# Altium schematic sheet TopLevel.SchDoc
size 420 x 297 mm; SheetNumber: 1; SheetTotal: 7
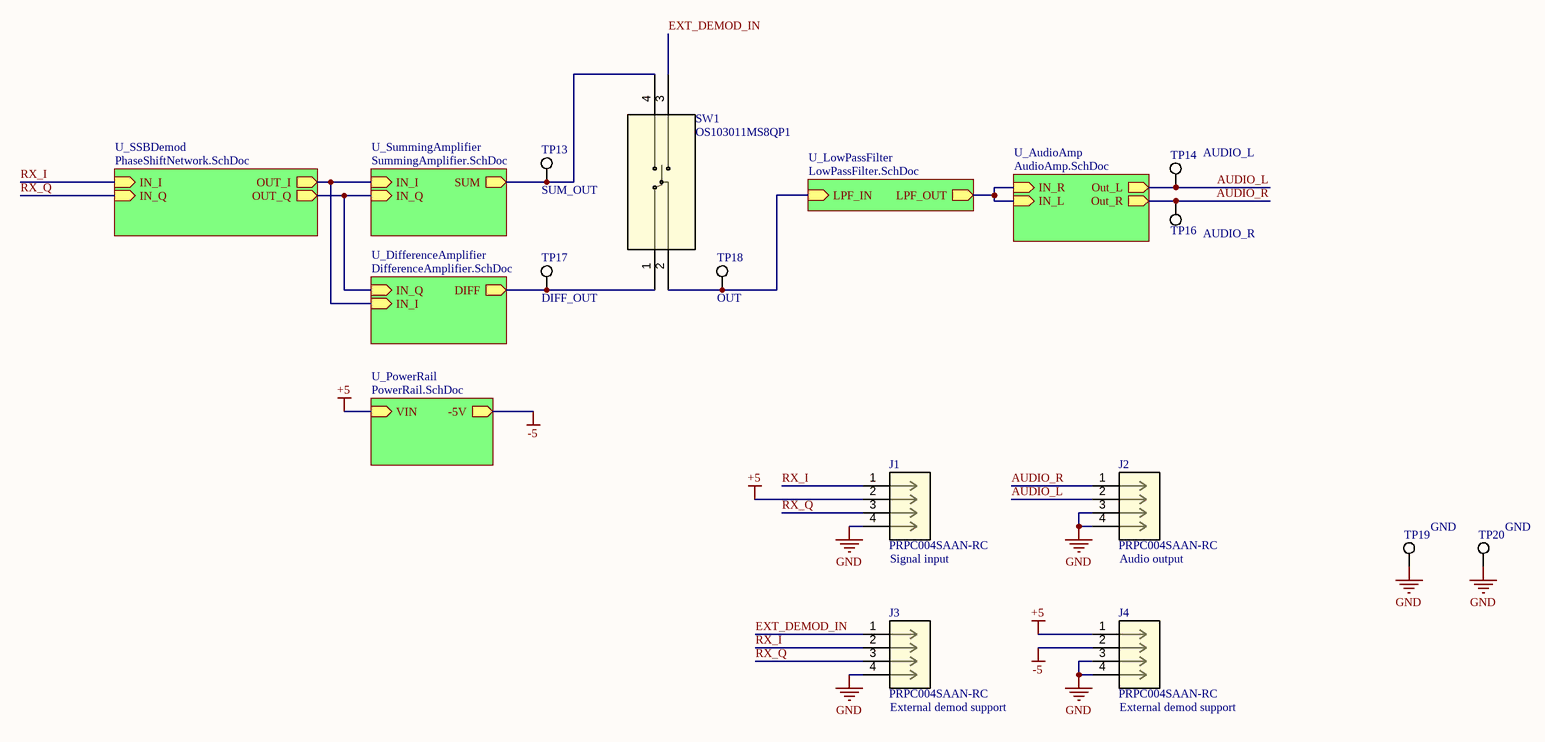
[diagram p0: TopLevel.SchDoc]

## Parts
J1  PRPC004SAAN-RC  [CONN4_PRPC004_SUL]
J2  PRPC004SAAN-RC  [CONN4_PRPC004_SUL]
J3  PRPC004SAAN-RC  [CONN4_PRPC004_SUL]
J4  PRPC004SAAN-RC  [CONN4_PRPC004_SUL]
SW1  OS103011MS8QP1  [DIP4_SP3T-TOP_4P3X8P6_CNK]
TP13  SUM_OUT  [KSTN-5019_V]
TP14  AUDIO_L  [KSTN-5019_V]
TP16  AUDIO_R  [KSTN-5019_V]
TP17  DIFF_OUT  [KSTN-5019_V]
TP18  OUT  [KSTN-5019_V]
TP19  GND  [KSTN-5019_V]
TP20  GND  [KSTN-5019_V]

## Sub-sheets
U_AudioAmp = AudioAmp.SchDoc: IN_R (in), IN_L (in), Out_L (out), Out_R (out)
U_DifferenceAmplifier = DifferenceAmplifier.SchDoc: DIFF (out), IN_Q (in), IN_I (in)
U_LowPassFilter = LowPassFilter.SchDoc: LPF_IN (in), LPF_OUT (out)
U_PowerRail = PowerRail.SchDoc: -5V (out), VIN (in)
U_SSBDemod = PhaseShiftNetwork.SchDoc: IN_I (in), IN_Q (in), OUT_I (out), OUT_Q (out)
U_SummingAmplifier = SummingAmplifier.SchDoc: IN_I (in), IN_Q (in), SUM (out)

## Nets
+5: J1.2 J4.1 ; sheet U_PowerRail/VIN
-5: J4.2 ; sheet U_PowerRail/-5V
GND: J1.4 J2.3 J2.4 J3.4 J4.3 J4.4 TP19.1 TP20.1
AUDIO_L: J2.2 TP14.1 ; sheet U_AudioAmp/Out_L
AUDIO_R: J2.1 TP16.1 ; sheet U_AudioAmp/Out_R
EXT_DEMOD_IN: J3.1 SW1.3
RX_I: J1.1 J3.2 ; sheet U_SSBDemod/IN_I
RX_Q: J1.3 J3.3 ; sheet U_SSBDemod/IN_Q
NetSW1_1: SW1.1 TP17.1 ; sheet U_DifferenceAmplifier/DIFF
NetSW1_2: SW1.2 TP18.1 ; sheet U_LowPassFilter/LPF_IN
NetSW1_4: SW1.4 TP13.1 ; sheet U_SummingAmplifier/SUM
(unnamed): sheet U_SSBDemod/OUT_I, sheet U_SummingAmplifier/IN_I, sheet U_DifferenceAmplifier/IN_I
(unnamed): sheet U_SSBDemod/OUT_Q, sheet U_SummingAmplifier/IN_Q, sheet U_DifferenceAmplifier/IN_Q
(unnamed): sheet U_AudioAmp/IN_R, sheet U_AudioAmp/IN_L, sheet U_LowPassFilter/LPF_OUT

## Notes on the sheet
- (near J1) Signal input
- (near J2) Audio output
- (near J3) External demod support
- (near J4) External demod support
- THIS DOCUMENT AND THE DATA DISCLOSED HEREIN OR
- HEREWITH IS THE PROPERTY OF ALTIUM LIMITED AND MAY
- DWG NO:
- REVISION
- REV:
- DESCRIPTION
- DATE
- APPROVED
- BE FREELY DISTRIBUTED IN WHOLE. NO RIGHTS ARE
- RESERVED OR EXPRESS OR IMPLIED WARANTEE GIVEN.
- ENG:
- APPROVALS
- PROJECT
- DSN:
- CHK:
- REFERENCE DOCUMENTS
- PROJECT REVISION:
- TITLE
- DOCUMENT REVISION:
- DESIGN ITEM:
- BOM:
- FAB DWG:
- PCB DWG:
- ASSY DWG:
- SCALE:
- A3
- SIZE
- CAGE CODE
- FILE NAME
- DWG NO.
- SHEET
- OF
- REV

## Library data of the parts
J1-J4 = PRPC004SAAN-RC: No Description Available; Mfr_Name: Sullins; Type: Headers, Male Pins; RefDes: RefDes
SW1 = OS103011MS8QP1: No Description Available; Mfr_Name: C&K Components; Type: Slide Switches; RefDes: RefDes
TP13 TP14 TP16-TP20 = CMP-1672-00008-1: Test Point, 1 Position SMD, RoHS, Tape and Reel; ComponentLink1Description: Manufacturer URL; Package Quantity: 1000; DatasheetVersion: 03/2014; Packaging: Tape and Reel; ComponentLink2URL: http://www.keyelco.com/product-pdf.cfm?p=1357; ComponentLink1URL: http://www.keyelco.com/; Mount: Surface Mount; Contact Plating: Silver; PackageDescription: 1-Pin Surface Mount Device, Body 3.81 x 2.03 mm; Pins: 1; RoHSCompliant: True; Mounting Technology: Surface Mount; ComponentLink2Description: Datasheet; PackageReference: 5019